# EAGLE schematic Power_Cape (EAGLE 7.7.0)
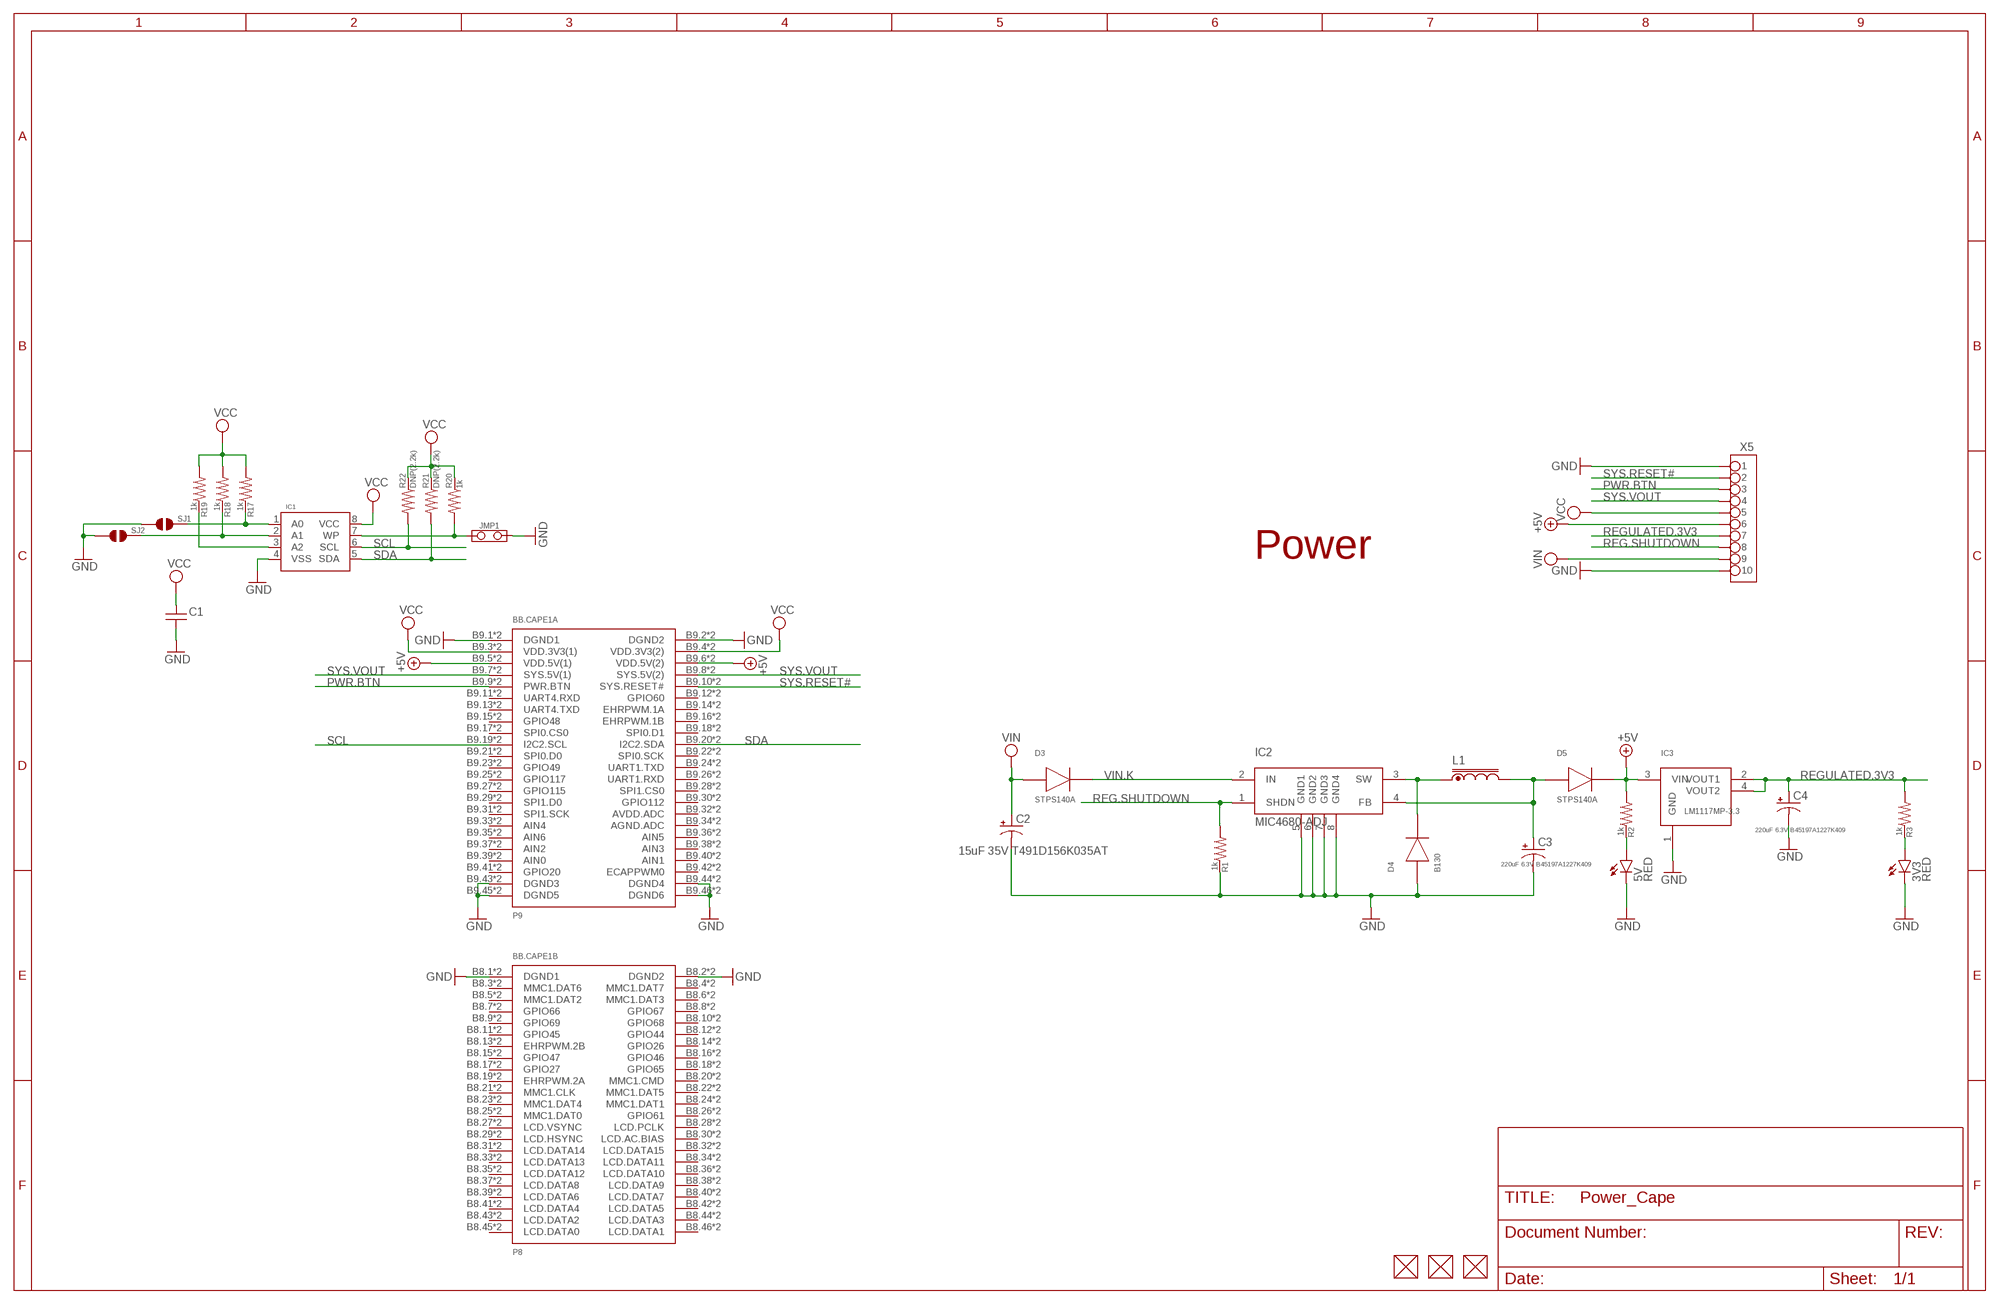
[diagram p0: schematic, sheet 1]

## Parts
3V3  RED  LED-(INCH)-0805  [0805-LED]
5V  RED  LED-(INCH)-0805  [0805-LED]
BB.CAPE1  BEAGLEBONE.CAPE.TOP/BOTTOM-PADS  [BEAGLEBONE.CAPE.TOP/BOTTOM-PADS]
C1  CAPACITOR-(INCH)-0402  [0402]
C2  15uF 35V T491D156K035AT  CPOL-USD/7343-31W  [D/7343-31W]
C3  220uF 6.3V B45197A1227K409  CPOL-USD/7343-31W  [D/7343-31W]
C4  220uF 6.3V B45197A1227K409  CPOL-USD/7343-31W  [D/7343-31W]
D3  STPS140A  DIODE_SMA  [DIODE_SMA]
D4  B130  DIODE_SMA  [DIODE_SMA]
D5  STPS140A  DIODE_SMA  [DIODE_SMA]
FUD1  FIDUCIAL  [FIDUCIAL_40MIL]
FUD2  FIDUCIAL  [FIDUCIAL_40MIL]
FUD3  FIDUCIAL  [FIDUCIAL_40MIL]
IC1  CAT24C32  [UDFN8,2X3(ON-SEMI)]
IC2  MIC4680-ADJ  MIC4680  [SO8]
IC3  LM1117MP-3.3  LM1117  [SOT223]
JMP1  JUMPER-(X2)  [JUMPER-(X2)]
L1  UP2B-XXX  [UP2B-(UNI-PAC)]
R1  1k  RESISTOR-(INCH)-0402  [0402]
R2  1k  RESISTOR-(INCH)-0402  [0402]
R3  1k  RESISTOR-(INCH)-0402  [0402]
R17  1k  RESISTOR-(INCH)-0402  [0402]
R18  1k  RESISTOR-(INCH)-0402  [0402]
R19  1k  RESISTOR-(INCH)-0402  [0402]
R20  1k  RESISTOR-(INCH)-0402  [0402]
R21  DNP(2.2k)  RESISTOR-(INCH)-0402  [0402]
R22  DNP(2.2k)  RESISTOR-(INCH)-0402  [0402]
SJ1  SOLDER.JOINT-(INCH)-0402  [SOLDER.JOINT(0402)]
SJ2  SOLDER.JOINT-(INCH)-0402  [SOLDER.JOINT(0402)]
X5  TB-10TERM-150MIL.PITCH  [TERMINAL.BLOCK-10TERM-150MIL.PITCH]

## Nets
5VOUT.A: D4.K IC2.3(SW) L1.1
5VOUT.B: C3.+ D5.A IC2.4(FB) L1.2
+5V [power]: BB.CAPE1.B9.5(A:VDD.5V(1)) BB.CAPE1.B9.6(A:VDD.5V(2)) BB.CAPE1.T9.5(A:VDD.5V(1)) BB.CAPE1.T9.6(A:VDD.5V(2)) D5.K IC3.3(VIN) R2.1 X5.6
A0: IC1.1(A0) R17.2 SJ1.2
A1: IC1.2(A1) R18.2 SJ2.2
A2: IC1.3(A2) R19.2
GND: 3V3.K 5V.K BB.CAPE1.B8.1(B:DGND1) BB.CAPE1.B8.2(B:DGND2) BB.CAPE1.B9.1(A:DGND1) BB.CAPE1.B9.2(A:DGND2) BB.CAPE1.B9.43(A:DGND3) BB.CAPE1.B9.44(A:DGND4) BB.CAPE1.B9.45(A:DGND5) BB.CAPE1.B9.46(A:DGND6) BB.CAPE1.T8.1(B:DGND1) BB.CAPE1.T8.2(B:DGND2) BB.CAPE1.T9.1(A:DGND1) BB.CAPE1.T9.2(A:DGND2) BB.CAPE1.T9.43(A:DGND3) BB.CAPE1.T9.44(A:DGND4) BB.CAPE1.T9.45(A:DGND5) BB.CAPE1.T9.46(A:DGND6) C1.2 C2.- C3.- C4.- D4.A IC1.4(VSS) IC2.5(GND1) IC2.6(GND2) IC2.7(GND3) IC2.8(GND4) IC3.1(GND) JMP1.2 R1.2 SJ1.1 SJ2.1 X5.1 X5.10
N$3: 5V.A R2.2
N$36: 3V3.A R3.2
PWR.BTN: BB.CAPE1.B9.9(A:PWR.BTN) BB.CAPE1.T9.9(A:PWR.BTN) X5.3
REG.SHUTDOWN: IC2.1(SHDN) R1.1 X5.8
REGULATED.3V3: C4.+ IC3.2(VOUT1) IC3.4(VOUT2) R3.1 X5.7
SCL: BB.CAPE1.B9.19(A:I2C2.SCL) BB.CAPE1.T9.19(A:I2C2.SCL) IC1.6(SCL) R22.1
SDA: BB.CAPE1.B9.20(A:I2C2.SDA) BB.CAPE1.T9.20(A:I2C2.SDA) IC1.5(SDA) R21.1
SYS.RESET#: BB.CAPE1.B9.10(A:SYS.RESET#) BB.CAPE1.T9.10(A:SYS.RESET#) X5.2
SYS.VOUT: BB.CAPE1.B9.7(A:SYS.5V(1)) BB.CAPE1.B9.8(A:SYS.5V(2)) BB.CAPE1.T9.7(A:SYS.5V(1)) BB.CAPE1.T9.8(A:SYS.5V(2)) X5.4
VCC: BB.CAPE1.B9.3(A:VDD.3V3(1)) BB.CAPE1.B9.4(A:VDD.3V3(2)) BB.CAPE1.T9.3(A:VDD.3V3(1)) BB.CAPE1.T9.4(A:VDD.3V3(2)) C1.1 IC1.8(VCC) R17.1 R18.1 R19.1 R20.2 R21.2 R22.2 X5.5
VIN: C2.+ D3.A X5.9
VIN.K: D3.K IC2.2(IN)
WP: IC1.7(WP) JMP1.1 R20.1
Unconnected: BB.CAPE1.B8.3(B:MMC1.DAT6) BB.CAPE1.B8.4(B:MMC1.DAT7) BB.CAPE1.B8.5(B:MMC1.DAT2) BB.CAPE1.B8.6(B:MMC1.DAT3) BB.CAPE1.B8.7(B:GPIO66) BB.CAPE1.B8.8(B:GPIO67) BB.CAPE1.B8.9(B:GPIO69) BB.CAPE1.B8.10(B:GPIO68) BB.CAPE1.B8.11(B:GPIO45) BB.CAPE1.B8.12(B:GPIO44) BB.CAPE1.B8.13(B:EHRPWM.2B) BB.CAPE1.B8.14(B:GPIO26) BB.CAPE1.B8.15(B:GPIO47) BB.CAPE1.B8.16(B:GPIO46) BB.CAPE1.B8.17(B:GPIO27) BB.CAPE1.B8.18(B:GPIO65) BB.CAPE1.B8.19(B:EHRPWM.2A) BB.CAPE1.B8.20(B:MMC1.CMD) BB.CAPE1.B8.21(B:MMC1.CLK) BB.CAPE1.B8.22(B:MMC1.DAT5) BB.CAPE1.B8.23(B:MMC1.DAT4) BB.CAPE1.B8.24(B:MMC1.DAT1) BB.CAPE1.B8.25(B:MMC1.DAT0) BB.CAPE1.B8.26(B:GPIO61) BB.CAPE1.B8.27(B:LCD.VSYNC) BB.CAPE1.B8.28(B:LCD.PCLK) BB.CAPE1.B8.29(B:LCD.HSYNC) BB.CAPE1.B8.30(B:LCD.AC.BIAS) BB.CAPE1.B8.31(B:LCD.DATA14) BB.CAPE1.B8.32(B:LCD.DATA15) BB.CAPE1.B8.33(B:LCD.DATA13) BB.CAPE1.B8.34(B:LCD.DATA11) BB.CAPE1.B8.35(B:LCD.DATA12) BB.CAPE1.B8.36(B:LCD.DATA10) BB.CAPE1.B8.37(B:LCD.DATA8) BB.CAPE1.B8.38(B:LCD.DATA9) BB.CAPE1.B8.39(B:LCD.DATA6) BB.CAPE1.B8.40(B:LCD.DATA7) BB.CAPE1.B8.41(B:LCD.DATA4) BB.CAPE1.B8.42(B:LCD.DATA5) BB.CAPE1.B8.43(B:LCD.DATA2) BB.CAPE1.B8.44(B:LCD.DATA3) BB.CAPE1.B8.45(B:LCD.DATA0) BB.CAPE1.B8.46(B:LCD.DATA1) BB.CAPE1.B9.11(A:UART4.RXD) BB.CAPE1.B9.12(A:GPIO60) BB.CAPE1.B9.13(A:UART4.TXD) BB.CAPE1.B9.14(A:EHRPWM.1A) BB.CAPE1.B9.15(A:GPIO48) BB.CAPE1.B9.16(A:EHRPWM.1B) BB.CAPE1.B9.17(A:SPI0.CS0) BB.CAPE1.B9.18(A:SPI0.D1) BB.CAPE1.B9.21(A:SPI0.D0) BB.CAPE1.B9.22(A:SPI0.SCK) BB.CAPE1.B9.23(A:GPIO49) BB.CAPE1.B9.24(A:UART1.TXD) BB.CAPE1.B9.25(A:GPIO117) BB.CAPE1.B9.26(A:UART1.RXD) BB.CAPE1.B9.27(A:GPIO115) BB.CAPE1.B9.28(A:SPI1.CS0) BB.CAPE1.B9.29(A:SPI1.D0) BB.CAPE1.B9.30(A:GPIO112) BB.CAPE1.B9.31(A:SPI1.SCK) BB.CAPE1.B9.32(A:AVDD.ADC) BB.CAPE1.B9.33(A:AIN4) BB.CAPE1.B9.34(A:AGND.ADC) BB.CAPE1.B9.35(A:AIN6) BB.CAPE1.B9.36(A:AIN5) BB.CAPE1.B9.37(A:AIN2) BB.CAPE1.B9.38(A:AIN3) BB.CAPE1.B9.39(A:AIN0) BB.CAPE1.B9.40(A:AIN1) BB.CAPE1.B9.41(A:GPIO20) BB.CAPE1.B9.42(A:ECAPPWM0) BB.CAPE1.T8.3(B:MMC1.DAT6) BB.CAPE1.T8.4(B:MMC1.DAT7) BB.CAPE1.T8.5(B:MMC1.DAT2) BB.CAPE1.T8.6(B:MMC1.DAT3) BB.CAPE1.T8.7(B:GPIO66) BB.CAPE1.T8.8(B:GPIO67) BB.CAPE1.T8.9(B:GPIO69) BB.CAPE1.T8.10(B:GPIO68) BB.CAPE1.T8.11(B:GPIO45) BB.CAPE1.T8.12(B:GPIO44) BB.CAPE1.T8.13(B:EHRPWM.2B) BB.CAPE1.T8.14(B:GPIO26) BB.CAPE1.T8.15(B:GPIO47) BB.CAPE1.T8.16(B:GPIO46) BB.CAPE1.T8.17(B:GPIO27) BB.CAPE1.T8.18(B:GPIO65) BB.CAPE1.T8.19(B:EHRPWM.2A) BB.CAPE1.T8.20(B:MMC1.CMD) BB.CAPE1.T8.21(B:MMC1.CLK) BB.CAPE1.T8.22(B:MMC1.DAT5) BB.CAPE1.T8.23(B:MMC1.DAT4) BB.CAPE1.T8.24(B:MMC1.DAT1) BB.CAPE1.T8.25(B:MMC1.DAT0) BB.CAPE1.T8.26(B:GPIO61) BB.CAPE1.T8.27(B:LCD.VSYNC) BB.CAPE1.T8.28(B:LCD.PCLK) BB.CAPE1.T8.29(B:LCD.HSYNC) BB.CAPE1.T8.30(B:LCD.AC.BIAS) BB.CAPE1.T8.31(B:LCD.DATA14) BB.CAPE1.T8.32(B:LCD.DATA15) BB.CAPE1.T8.33(B:LCD.DATA13) BB.CAPE1.T8.34(B:LCD.DATA11) BB.CAPE1.T8.35(B:LCD.DATA12) BB.CAPE1.T8.36(B:LCD.DATA10) BB.CAPE1.T8.37(B:LCD.DATA8) BB.CAPE1.T8.38(B:LCD.DATA9) BB.CAPE1.T8.39(B:LCD.DATA6) BB.CAPE1.T8.40(B:LCD.DATA7) BB.CAPE1.T8.41(B:LCD.DATA4) BB.CAPE1.T8.42(B:LCD.DATA5) BB.CAPE1.T8.43(B:LCD.DATA2) BB.CAPE1.T8.44(B:LCD.DATA3) BB.CAPE1.T8.45(B:LCD.DATA0) BB.CAPE1.T8.46(B:LCD.DATA1) BB.CAPE1.T9.11(A:UART4.RXD) BB.CAPE1.T9.12(A:GPIO60) BB.CAPE1.T9.13(A:UART4.TXD) BB.CAPE1.T9.14(A:EHRPWM.1A) BB.CAPE1.T9.15(A:GPIO48) BB.CAPE1.T9.16(A:EHRPWM.1B) BB.CAPE1.T9.17(A:SPI0.CS0) BB.CAPE1.T9.18(A:SPI0.D1) BB.CAPE1.T9.21(A:SPI0.D0) BB.CAPE1.T9.22(A:SPI0.SCK) BB.CAPE1.T9.23(A:GPIO49) BB.CAPE1.T9.24(A:UART1.TXD) BB.CAPE1.T9.25(A:GPIO117) BB.CAPE1.T9.26(A:UART1.RXD) BB.CAPE1.T9.27(A:GPIO115) BB.CAPE1.T9.28(A:SPI1.CS0) BB.CAPE1.T9.29(A:SPI1.D0) BB.CAPE1.T9.30(A:GPIO112) BB.CAPE1.T9.31(A:SPI1.SCK) BB.CAPE1.T9.32(A:AVDD.ADC) BB.CAPE1.T9.33(A:AIN4) BB.CAPE1.T9.34(A:AGND.ADC) BB.CAPE1.T9.35(A:AIN6) BB.CAPE1.T9.36(A:AIN5) BB.CAPE1.T9.37(A:AIN2) BB.CAPE1.T9.38(A:AIN3) BB.CAPE1.T9.39(A:AIN0) BB.CAPE1.T9.40(A:AIN1) BB.CAPE1.T9.41(A:GPIO20) BB.CAPE1.T9.42(A:ECAPPWM0) FUD1.P$1 FUD2.P$1 FUD3.P$1

## Notes on the sheet
- Power

## Library data of the parts
3V3 5V = GHI-BasicComponents:LED-(INCH)-: Basic SMD LEDs
BB.CAPE1 = GHI-Solutions:BEAGLEBONE.CAPE.
C1 = GHI-BasicComponents:CAPACITOR-(INCH)-: Basic SMD ceramic capacitors
C2-C4 = rcl:CPOL-US: POLARIZED CAPACITOR, American symbol
D3-D5 = GHI:DIODE_SMA
FUD1-FUD3 = GHI:FIDUCIAL
IC1 = GHI-IC:CAT24C32: 32-Kb I2C CMOS Serial EEPROM
IC2 = GHI:MIC4680
IC3 = GHI:LM1117
JMP1 = GHI-Headers:JUMPER-(X2)
L1 = GHI-BasicComponents:UP2B-XXX: UNI-PAC Drum core power inductors
R1-R3 R17-R22 = GHI-BasicComponents:RESISTOR-(INCH)-: Basic SMD Resistors
SJ1 SJ2 = GHI-Miscellaneous:SOLDER.JOINT-(INCH)-: Solder Joint (Bridge) Pads - For easy solder joining.
X5 = GHI-Connectors:TB-10TERM-150MIL.PITCH